# Altium project ZettBrettBoard.PrjPcb (part 2 of 2)
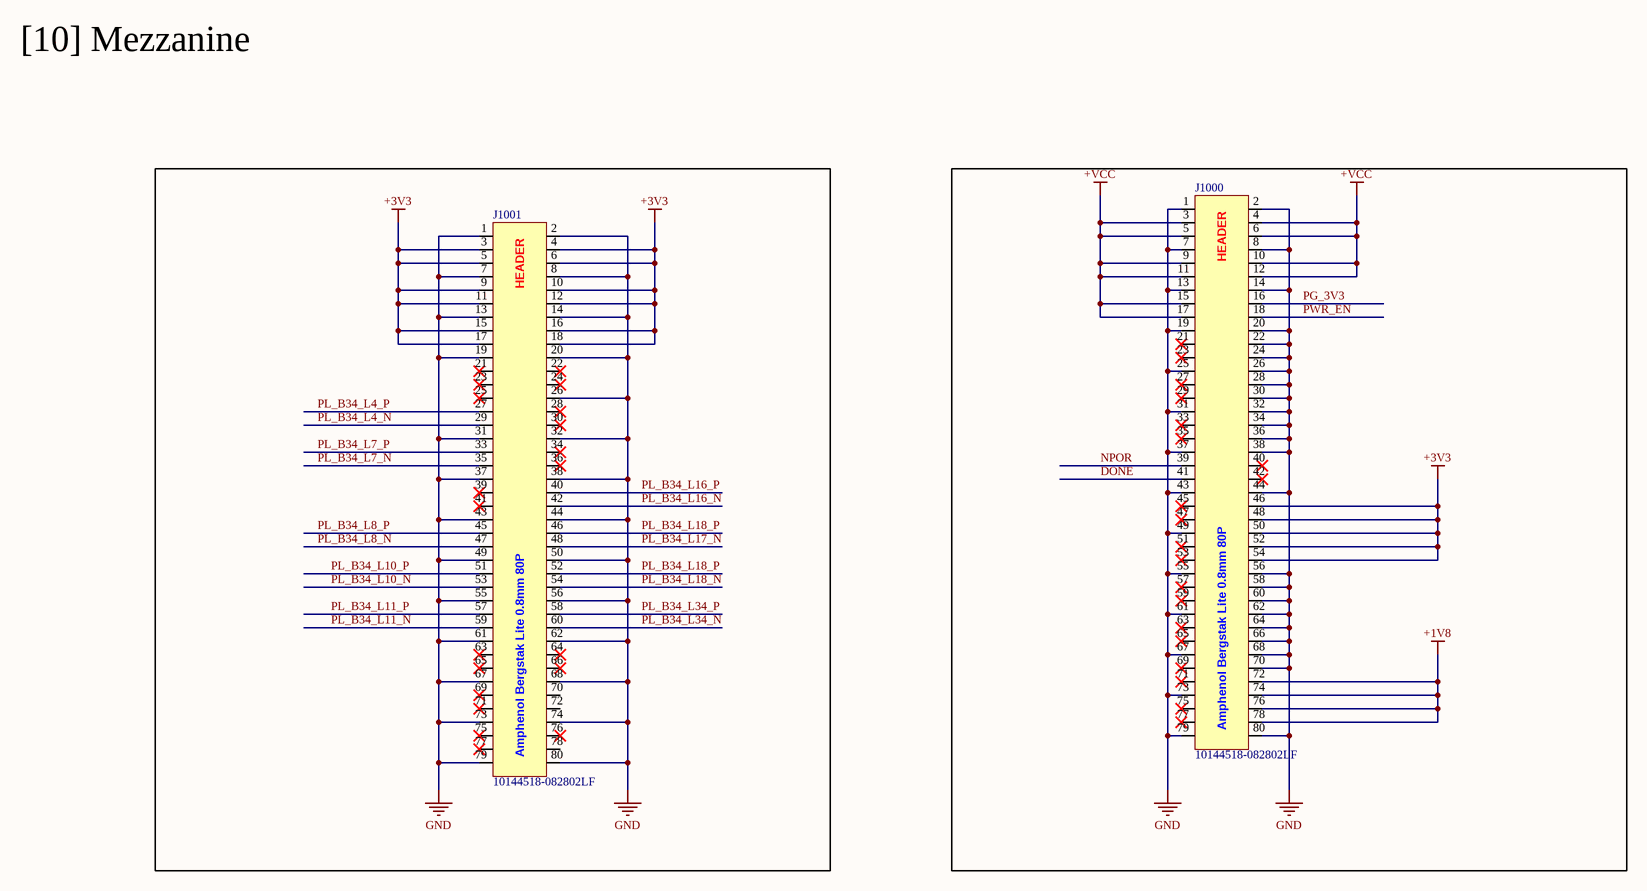
[diagram p11: Mezzanine.SchDoc]

## Nets that join several sheets
+0V675: Power (C125.2 C126.2 U105.3 U105.8), Zynq DDR Interface & Termination (39 pins)
+1V0: Power (5 pins), Zynq-Power (16 pins)
+1V8: Power (5 pins), Zynq-Power (16 pins), Zynq Config - JTAG - Debug (C301.2 C302.2 U300#1.E6    U300#1.F7   ), Gigabit Ethernet (5 pins), USB 2 High Speed (OTG) (10 pins), Mezzanine (J1000.72 J1000.74 J1000.76 J1000.78)
+1V35: Power (6 pins), Zynq DDR Interface & Termination (R527.2), DDR3L (39 pins)
+3V3: Power (5 pins), Zynq Config - JTAG - Debug (39 pins), Zynq Processing System (PS) (36 pins), Zynq DDR Interface & Termination (6 pins), Zynq Programmable Logic System (PL) (16 pins), Gigabit Ethernet (9 pins), Mezzanine (17 pins)
+5V: Power (21 pins), USB 2 High Speed (OTG) (5 pins)
+VCC: Power (7 pins), Zynq Config - JTAG - Debug (7 pins), Mezzanine (10 pins)
FB_1V0: Power (68 pins), Zynq-Power (47 pins), Zynq Config - JTAG - Debug (56 pins), Zynq Processing System (PS) (26 pins), Zynq DDR Interface & Termination (16 pins), Zynq Programmable Logic System (PL) (9 pins), Gigabit Ethernet (46 pins), USB 2 High Speed (OTG) (24 pins), DDR3L (43 pins), Mezzanine (64 pins)
DDR_A0: Zynq DDR Interface & Termination (R500.1 U600.P1   ), DDR3L (U900.N3)
DDR_A1: Zynq DDR Interface & Termination (R501.1 U600.N1   ), DDR3L (U900.P7)
DDR_A2: Zynq DDR Interface & Termination (R502.1 U600.M1   ), DDR3L (U900.P3)
DDR_A3: Zynq DDR Interface & Termination (R503.1 U600.M4   ), DDR3L (U900.N2)
DDR_A4: Zynq DDR Interface & Termination (R504.1 U600.P3   ), DDR3L (U900.P8)
DDR_A5: Zynq DDR Interface & Termination (R505.1 U600.P4   ), DDR3L (U900.P2)
DDR_A6: Zynq DDR Interface & Termination (R506.1 U600.P5   ), DDR3L (U900.R8)
DDR_A7: Zynq DDR Interface & Termination (R507.1 U600.M5   ), DDR3L (U900.R2)
DDR_A8: Zynq DDR Interface & Termination (R508.1 U600.P6   ), DDR3L (U900.T8)
DDR_A9: Zynq DDR Interface & Termination (R509.1 U600.N4   ), DDR3L (U900.R3)
DDR_A10: Zynq DDR Interface & Termination (R510.1 U600.J1   ), DDR3L (U900.L7)
DDR_A11: Zynq DDR Interface & Termination (R511.1 U600.L2   ), DDR3L (U900.R7)
DDR_A12: Zynq DDR Interface & Termination (R512.1 U600.M2   ), DDR3L (U900.N7)
DDR_A13: Zynq DDR Interface & Termination (R513.1 U600.K2   ), DDR3L (U900.T3)
DDR_A14: Zynq DDR Interface & Termination (R514.1 U600.K1   ), DDR3L (U900.T7)
DDR_BA0: Zynq DDR Interface & Termination (R515.1 U600.M6   ), DDR3L (U900.M2)
DDR_BA1: Zynq DDR Interface & Termination (R516.1 U600.R1   ), DDR3L (U900.N8)
DDR_BA2: Zynq DDR Interface & Termination (R517.1 U600.N6   ), DDR3L (U900.M3)
DDR_CK_N: Zynq DDR Interface & Termination (R526.1 U600.N2   ), DDR3L (U900.K7)
DDR_CK_P: Zynq DDR Interface & Termination (R525.1 U600.N3   ), DDR3L (U900.J7)
DDR_CKE: Zynq DDR Interface & Termination (R521.1 U600.L3   ), DDR3L (U900.K9)
DDR_DM0: Zynq DDR Interface & Termination (U600.B1   ), DDR3L (U900.D3)
DDR_DM1: Zynq DDR Interface & Termination (U600.D3   ), DDR3L (U900.E7)
DDR_DQ6: Zynq DDR Interface & Termination (U600.C3   ), DDR3L (U900.C3)
DDR_DQ7: Zynq DDR Interface & Termination (U600.A3   ), DDR3L (U900.D7)
DDR_DQ8: Zynq DDR Interface & Termination (U600.E1   ), DDR3L (U900.H7)
DDR_DQ9: Zynq DDR Interface & Termination (U600.D1   ), DDR3L (U900.G2)
DDR_DQ10: Zynq DDR Interface & Termination (U600.E2   ), DDR3L (U900.H8)
DDR_DQ11: Zynq DDR Interface & Termination (U600.E3   ), DDR3L (U900.H3)
DDR_DQ12: Zynq DDR Interface & Termination (U600.F3   ), DDR3L (U900.F8)
DDR_DQ13: Zynq DDR Interface & Termination (U600.G1   ), DDR3L (U900.F2)
DDR_DQ14: Zynq DDR Interface & Termination (U600.H1   ), DDR3L (U900.F7)
DDR_DQ15: Zynq DDR Interface & Termination (U600.H2   ), DDR3L (U900.E3)
DDR_DQS0_N: Zynq DDR Interface & Termination (U600.B2   ), DDR3L (U900.B7)
DDR_DQS0_P: Zynq DDR Interface & Termination (U600.C2   ), DDR3L (U900.C7)
DDR_DQS1_N: Zynq DDR Interface & Termination (U600.F2   ), DDR3L (U900.G3)
DDR_DQS1_P: Zynq DDR Interface & Termination (U600.G2   ), DDR3L (U900.F3)
DDR_NCAS: Zynq DDR Interface & Termination (R519.1 U600.R5   ), DDR3L (U900.K3)
DDR_NCS: Zynq DDR Interface & Termination (R523.1 U600.R2   ), DDR3L (U900.L2)
DDR_NRAS: Zynq DDR Interface & Termination (R518.1 U600.R6   ), DDR3L (U900.J3)
DDR_NRST: Zynq DDR Interface & Termination (R524.1 U600.L4   ), DDR3L (U900.T2)
DDR_NWE: Zynq DDR Interface & Termination (R520.1 U600.R3   ), DDR3L (U900.L3)
DDR_ODT: Zynq DDR Interface & Termination (R522.1 U600.K3   ), DDR3L (U900.K1)
DONE: Zynq Config - JTAG - Debug (Q300.G R303.1 U300#1.M7   ), Mezzanine (J1000.41)
ETH_MDC: Zynq Processing System (PS) (U401#2.D13  ), Gigabit Ethernet (U700.13)
ETH_MDIO: Zynq Processing System (PS) (U401#2.B12  ), Gigabit Ethernet (R705.1 U700.14)
ETH_NINT: Zynq Processing System (PS) (U400#1.C6    U401#2.A12  ), Gigabit Ethernet (R704.1 U700.31)
ETH_NRST_+3V3: Zynq Processing System (PS) (U401#2.C13  ), Gigabit Ethernet (U700.12)
ETH_PHY_TXCLK: Zynq DDR Interface & Termination (U600.A4   ), Gigabit Ethernet (U700.20)
ETH_PHY_TXCTL: Zynq DDR Interface & Termination (U600.B4   ), Gigabit Ethernet (U700.19)
ETH_PHY_TXD0: Zynq DDR Interface & Termination (U600.D4   ), Gigabit Ethernet (U700.18)
ETH_PHY_TXD1: Zynq DDR Interface & Termination (U600.A2   ), Gigabit Ethernet (U700.17)
ETH_PHY_TXD2: Zynq DDR Interface & Termination (U600.C4   ), Gigabit Ethernet (U700.16)
ETH_PHY_TXD3: Zynq DDR Interface & Termination (U600.C1   ), Gigabit Ethernet (U700.15)
FLASH_CLK_M4: Zynq Config - JTAG - Debug (R332.2), Zynq Processing System (PS) (R401.2 U400#2.6)
NPOR: Zynq Config - JTAG - Debug (R314.1), Zynq Processing System (PS) (C403.2 R403.2 U400#1.C9    U401#1.4), Mezzanine (J1000.39)
PG_3V3: Power (5 pins), Zynq Processing System (PS) (U401#1.2), Mezzanine (J1000.16)
PL_B34_L4_N: Zynq Programmable Logic System (PL) (U600.K15  ), Mezzanine (J1001.29)
PL_B34_L4_P: Zynq Programmable Logic System (PL) (U600.J15  ), Mezzanine (J1001.27)
PL_B34_L7_N: Zynq Programmable Logic System (PL) (U600.N14  ), Mezzanine (J1001.35)
PL_B34_L7_P: Zynq Programmable Logic System (PL) (U600.N13  ), Mezzanine (J1001.33)
PL_B34_L8_N: Zynq Programmable Logic System (PL) (U600.M15  ), Mezzanine (J1001.47)
PL_B34_L8_P: Zynq Programmable Logic System (PL) (U600.L15  ), Mezzanine (J1001.45)
PL_B34_L10_N: Zynq Programmable Logic System (PL) (U600.L13  ), Mezzanine (J1001.53)
PL_B34_L10_P: Zynq Programmable Logic System (PL) (U600.K13  ), Mezzanine (J1001.51)
PL_B34_L11_N: Zynq Programmable Logic System (PL) (U600.K12  ), Mezzanine (J1001.59)
PL_B34_L11_P: Zynq Programmable Logic System (PL) (U600.K11  ), Mezzanine (J1001.57)
PL_B34_L16_N: Zynq Programmable Logic System (PL) (U600.R11  ), Mezzanine (J1001.42)
PL_B34_L16_P: Zynq Programmable Logic System (PL) (U600.P11  ), Mezzanine (J1001.40)
PL_B34_L17_N: Zynq Programmable Logic System (PL) (U600.R13  ), Mezzanine (J1001.48)
PL_B34_L18_N: Zynq Programmable Logic System (PL) (U600.P14  ), Mezzanine (J1001.54)
PL_B34_L18_P: Zynq Programmable Logic System (PL) (U600.P13   U600.R12  ), Mezzanine (J1001.46 J1001.52)
PL_B34_L34_N: Zynq Programmable Logic System (PL) (U600.N8   ), Mezzanine (J1001.60)
PL_B34_L34_P: Zynq Programmable Logic System (PL) (U600.N7   ), Mezzanine (J1001.58)
PL_CLK_125MHZ: Zynq Programmable Logic System (PL) (U600.L12  ), Gigabit Ethernet (R703.2)
PWR_EN: Power (C101.2 R100.1 U100.7), Mezzanine (J1000.18)
QSPI_DQ1_M1: Zynq Config - JTAG - Debug (R326.2), Zynq Processing System (PS) (U400#1.C8    U400#2.2)
QSPI_DQ2_M2: Zynq Config - JTAG - Debug (R327.2), Zynq Processing System (PS) (U400#1.A7    U400#2.3)
QSPI_DQ2_M3: Zynq Config - JTAG - Debug (R331.2), Zynq Processing System (PS) (U400#1.A5   )
QSPI_DQ3_M0: Zynq Config - JTAG - Debug (R325.2), Zynq Processing System (PS) (U400#1.A8    U400#2.7)
UART_RX: Zynq Config - JTAG - Debug (R315.1), Zynq Processing System (PS) (U400#1.B9   )
UART_TX_VCFGI: Zynq Config - JTAG - Debug (R316.1), Zynq Processing System (PS) (U400#1.D10  )
USB_CLK: Zynq Processing System (PS) (U401#2.D14  ), USB 2 High Speed (OTG) (U800.1)
USB_DATA0: Zynq Processing System (PS) (U401#2.A15  ), USB 2 High Speed (OTG) (U800.3)
USB_DATA1: Zynq Processing System (PS) (U401#2.D11  ), USB 2 High Speed (OTG) (U800.4)
USB_DATA2: Zynq Processing System (PS) (U401#2.B15  ), USB 2 High Speed (OTG) (U800.5)
USB_DATA3: Zynq Processing System (PS) (U401#2.C12  ), USB 2 High Speed (OTG) (U800.6)
USB_DATA4: Zynq Processing System (PS) (U401#2.E15  ), USB 2 High Speed (OTG) (U800.7)
USB_DATA5: Zynq Processing System (PS) (U401#2.C11  ), USB 2 High Speed (OTG) (U800.9)
USB_DATA6: Zynq Processing System (PS) (U401#2.D15  ), USB 2 High Speed (OTG) (U800.10)
USB_DATA7: Zynq Processing System (PS) (U401#2.A14  ), USB 2 High Speed (OTG) (U800.13)
USB_DIR: Zynq Processing System (PS) (U401#2.A13  ), USB 2 High Speed (OTG) (U800.31)
USB_NXT: Zynq Processing System (PS) (U401#2.C14  ), USB 2 High Speed (OTG) (U800.2)
USB_STP: Zynq Processing System (PS) (U401#2.B14  ), USB 2 High Speed (OTG) (U800.29)